# Altium project PeltierCore.PrjPcb
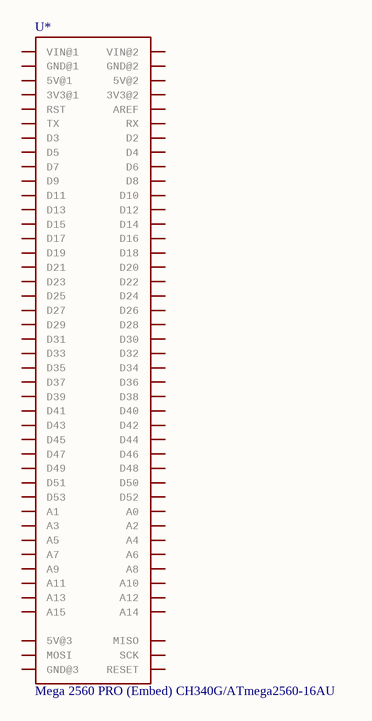
[diagram p0: PeltierCore.SchDoc]
1 sheet, 1 parts. Net scope: global (net labels, ports and power ports of the same name join across sheets).
Board file: PeltierCore.PcbDoc

## Sheet PeltierCore.SchDoc
size A4; SheetNumber: 1; SheetTotal: 1

### Parts
U*  Mega 2560 PRO (Embed) CH340G/ATmega2560-16AU  [Mega 2560 PRO (Embed)]

### Nets

Not connected (* = marked no-connect by the designer): U* 3V3@1 3V3@2 5V@1 5V@2 5V@3 A0 A1 A2 A3 A4 A5 A6 A7 A8 A9 A10 A11 A12 A13 A14 A15 AREF D2 D3 D4 D5 D6 D7 D8 D9 D10 D11 D12 D13 D14 D15 D16 D17 D18 D19 D20 D21 D22 D23 D24 D25 D26 D27 D28 D29 D30 D31 D32 D33 D34 D35 D36 D37 D38 D39 D40 D41 D42 D43 D44 D45 D46 D47 D48 D49 D50 D51 D52 D53 GND@1 GND@2 GND@3 MISO MOSI RESET RST RX SCK TX VIN@1 VIN@2

### Library data of the parts
U* = Mega 2560 PRO (Embed): The Mega Pro Embed CH340G / ATmega2560 board is based on the ATmega2560 microcontroller and the USB-UART adapter CH340. The board is compatible with Arduino Mega 2560.